# Altium project 温控板.PRJPCB
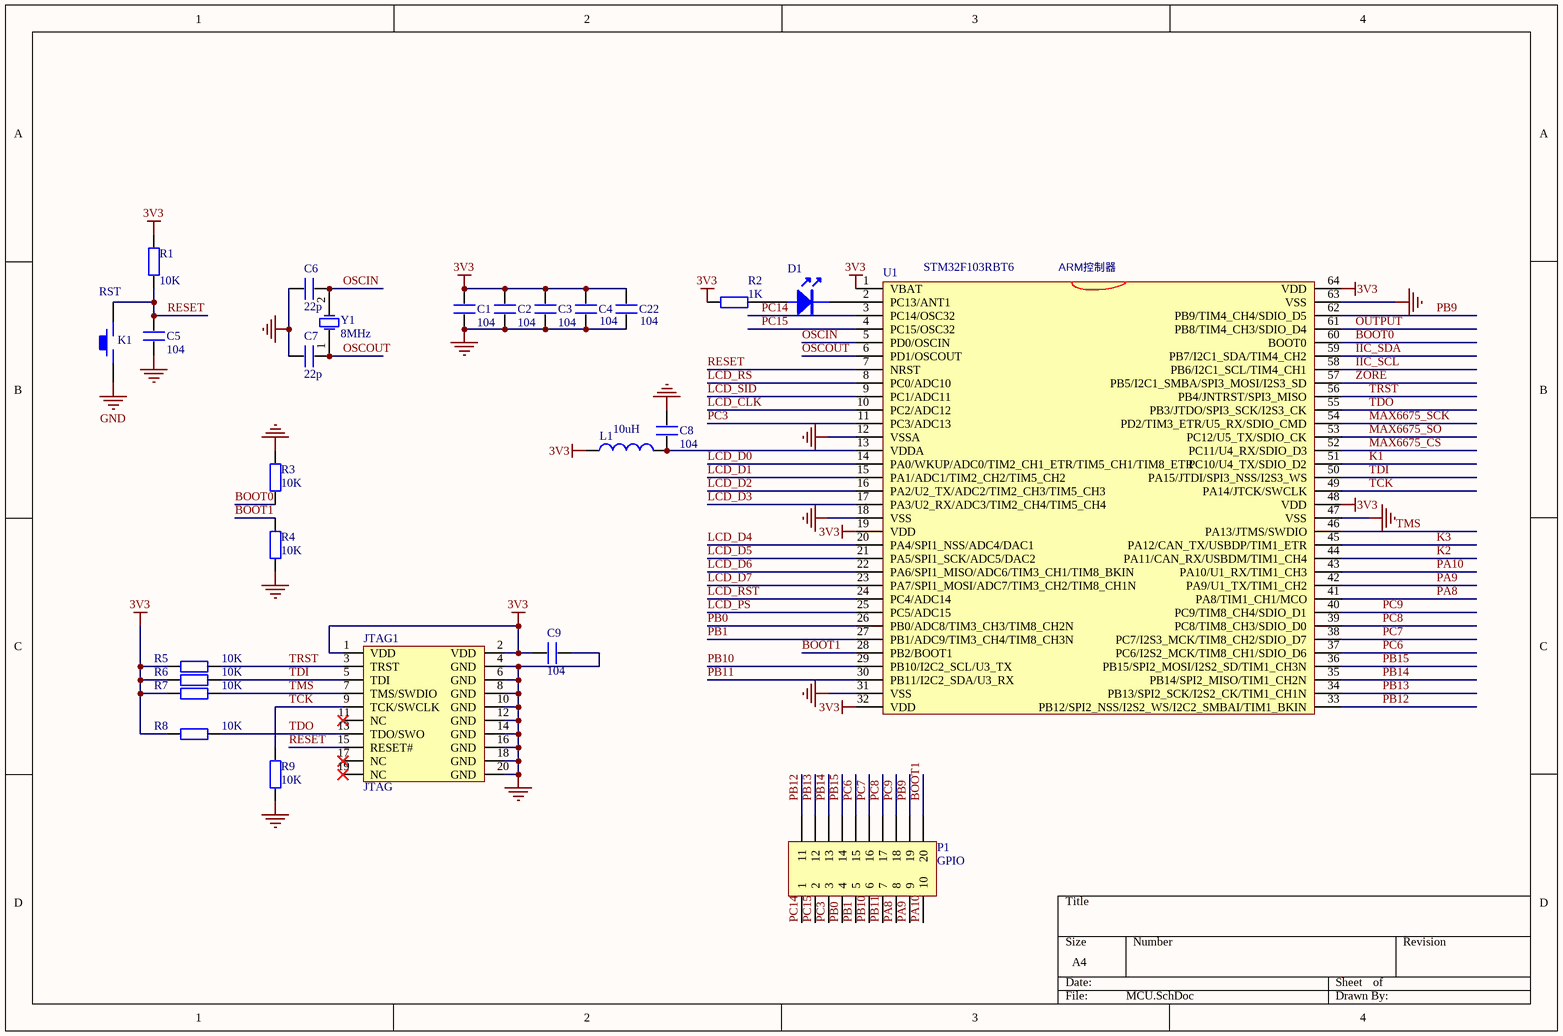
[diagram p0: MCU.SchDoc]
4 sheets, 94 parts. Net scope: global (net labels, ports and power ports of the same name join across sheets).
Board file: 温控PCB_0617F.PcbDoc
Sheets:
  MCU.SchDoc
  MCU电源.SchDoc
  MAX6675.SchDoc
  输出.SchDoc

## Sheet MCU.SchDoc
size A4

### Parts
C1  104  [1206]
C2  104  [1206]
C3  104  [1206]
C4  104  [1206]
C5  104  [1206]
C6  22p  [1206]
C7  22p  [1206]
C8  104  [1206]
C9  104  [1206]
C22  104  [1206]
D1  (no value)  [LED]
JTAG1  JTAG  [JTAG_20]
K1  RST  [KEY_M]
L1  10uH  [1206]
P1  GPIO  [HDR2X10_CEN]
R1  value 10K  [1206]
R2  1K  [1206]
R3  10K  [1206]
R4  10K  [1206]
R5  10K  [1206]
R6  10K  [1206]
R7  10K  [1206]
R8  10K  [1206]
R9  10K  [1206]
U1  STM32F103RBT6  [LQFP64]
Y1  8MHz  [XTAL_US]

### Nets
3V3: C1.1 C2.1 C3.1 C4.1 C9.1 C22.1 JTAG1.1(VDD) JTAG1.2(VDD) L1.1 R1.1 R2.1 R5.1 R6.2 R7.2 R8.2 U1.1(VBAT) U1.19(VDD) U1.32(VDD) U1.48(VDD) U1.64(VDD)
GND: C1.2 C2.2 C3.2 C4.2 C5.2 C6.2 C7.1 C8.1 C9.2 C22.2 JTAG1.4(GND) JTAG1.6(GND) JTAG1.8(GND) JTAG1.10(GND) JTAG1.12(GND) JTAG1.14(GND) JTAG1.16(GND) JTAG1.18(GND) JTAG1.20(GND) K1.1 R3.2 R4.1 R9.1 U1.12(VSSA) U1.18(VSS) U1.31(VSS) U1.47(VSS) U1.63(VSS)
BOOT0: R3.1 U1.60(BOOT0)
BOOT1: P1.20 R4.2 U1.28(PB2/BOOT1)
IIC_SCL: U1.58(PB6/I2C1_SCL/TIM4_CH1)
IIC_SDA: U1.59(PB7/I2C1_SDA/TIM4_CH2)
K1: U1.51(PC10/U4_TX/SDIO_D2)
K2: U1.44(PA11/CAN_RX/USBDM/TIM1_CH4)
K3: U1.45(PA12/CAN_TX/USBDP/TIM1_ETR)
LCD_CLK: U1.10(PC2/ADC12)
LCD_D0: U1.14(PA0/WKUP/ADC0/TIM2_CH1_ETR/TIM5_CH1/TIM8_ETR)
LCD_D1: U1.15(PA1/ADC1/TIM2_CH2/TIM5_CH2)
LCD_D2: U1.16(PA2/U2_TX/ADC2/TIM2_CH3/TIM5_CH3)
LCD_D3: U1.17(PA3/U2_RX/ADC3/TIM2_CH4/TIM5_CH4)
LCD_D4: U1.20(PA4/SPI1_NSS/ADC4/DAC1)
LCD_D5: U1.21(PA5/SPI1_SCK/ADC5/DAC2)
LCD_D6: U1.22(PA6/SPI1_MISO/ADC6/TIM3_CH1/TIM8_BKIN)
LCD_D7: U1.23(PA7/SPI1_MOSI/ADC7/TIM3_CH2/TIM8_CH1N)
LCD_PS: U1.25(PC5/ADC15)
LCD_RS: U1.8(PC0/ADC10)
LCD_RST: U1.24(PC4/ADC14)
LCD_SID: U1.9(PC1/ADC11)
MAX6675_CS: U1.52(PC11/U4_RX/SDIO_D3)
MAX6675_SCK: U1.54(PD2/TIM3_ETR/U5_RX/SDIO_CMD)
MAX6675_SO: U1.53(PC12/U5_TX/SDIO_CK)
OSCIN: C6.1 U1.5(PD0/OSCIN) Y1.2(OSC2)
OSCOUT: C7.2 U1.6(PD1/OSCOUT) Y1.1(OSC1)
OUTPUT: U1.61(PB8/TIM4_CH3/SDIO_D4)
PA8: P1.8 U1.41(PA8/TIM1_CH1/MCO)
PA9: P1.9 U1.42(PA9/U1_TX/TIM1_CH2)
PA10: P1.10 U1.43(PA10/U1_RX/TIM1_CH3)
PB0: P1.4 U1.26(PB0/ADC8/TIM3_CH3/TIM8_CH2N)
PB1: P1.5 U1.27(PB1/ADC9/TIM3_CH4/TIM8_CH3N)
PB9: P1.19 U1.62(PB9/TIM4_CH4/SDIO_D5)
PB10: P1.6 U1.29(PB10/I2C2_SCL/U3_TX)
PB11: P1.7 U1.30(PB11/I2C2_SDA/U3_RX)
PB12: P1.11 U1.33(PB12/SPI2_NSS/I2S2_WS/I2C2_SMBAI/TIM1_BKIN)
PB13: P1.12 U1.34(PB13/SPI2_SCK/I2S2_CK/TIM1_CH1N)
PB14: P1.13 U1.35(PB14/SPI2_MISO/TIM1_CH2N)
PB15: P1.14 U1.36(PB15/SPI2_MOSI/I2S2_SD/TIM1_CH3N)
PC3: P1.3 U1.11(PC3/ADC13)
PC6: P1.15 U1.37(PC6/I2S2_MCK/TIM8_CH1/SDIO_D6)
PC7: P1.16 U1.38(PC7/I2S3_MCK/TIM8_CH2/SDIO_D7)
PC8: P1.17 U1.39(PC8/TIM8_CH3/SDIO_D0)
PC9: P1.18 U1.40(PC9/TIM8_CH4/SDIO_D1)
PC14: P1.1 U1.3(PC14/OSC32)
PC15: P1.2 U1.4(PC15/OSC32)
RESET: C5.1 JTAG1.15(RESET#) K1.2 R1.2 U1.7(NRST)
TCK: JTAG1.9(TCK/SWCLK) R9.2 U1.49(PA14/JTCK/SWCLK)
TDI: JTAG1.5(TDI) R6.1 U1.50(PA15/JTDI/SPI3_NSS/I2S3_WS)
TDO: JTAG1.13(TDO/SWO) R8.1 U1.55(PB3/JTDO/SPI3_SCK/I2S3_CK)
TMS: JTAG1.7(TMS/SWDIO) R7.1 U1.46(PA13/JTMS/SWDIO)
TRST: JTAG1.3(TRST) R5.2 U1.56(PB4/JNTRST/SPI3_MISO)
ZORE: U1.57(PB5/I2C1_SMBA/SPI3_MOSI/I2S3_SD)
NetC8_2: C8.2 L1.2 U1.13(VDDA)
NetD1_A: D1.A R2.2
NetD1_K: D1.K U1.2(PC13/ANT1)

Not connected (* = marked no-connect by the designer): JTAG1 11(NC)* 17(NC)* 19(NC)*

### Notes on the sheet
- (near U1) ARM控制器

### Library data of the parts
C1-C9 C22 = C
D1 = 发光二极管
K1 = KEY_M
L1 = Inductor: Code_IEC: 1005; Published: 8-Jun-2000; LatestRevisionDate: 29-May-2009; LatestRevisionNote: IPC-7351 Footprint Added.; PackageReference: 0402-A; Publisher: Altium Limited; PackageDescription: Chip Inductor; Code_JEITA: 0402
P1 = Header 10X2A: Header, 10-Pin, Dual row; LatestRevisionDate: 17-Jul-2002; LatestRevisionNote: Re-released for DXP Platform.; Publisher: Altium Limited
R1 R3-R6 R8 R9 = Res2: Resistor; Published: 8-Jun-2000; LatestRevisionDate: 17-Jul-2002; LatestRevisionNote: Re-released for DXP Platform.; PackageReference: AXIAL-0.4; Publisher: Altium Limited; PackageDescription: Axial Device, Thru-Hole; 2 Leads; 0.4 in Pin Spacing
  R3-R6 R8 R9: Value: 10K
R2 = Res2: Resistor; Value: 10K; Published: 8-Jun-2000; LatestRevisionDate: 17-Jul-2002; LatestRevisionNote: Re-released for DXP Platform.; PackageReference: AXIAL-0.4; Publisher: Altium Limited; PackageDescription: Axial Device, Thru-Hole; 2 Leads; 0.4 in Pin Spacing
R7 = Res2: Resistor; Rule: PcbType=ProtelPcb; Published: 8-Jun-2000; LatestRevisionDate: 17-Jul-2002; LatestRevisionNote: Re-released for DXP Platform.; PackageReference: AXIAL-0.4; Publisher: Altium Limited; PackageDescription: Axial Device, Thru-Hole; 2 Leads; 0.4 in Pin Spacing; Value: 10K
U1 = STM32F103RDT6
Y1 = XTAL: Crystal Oscillator; Published: 8-Jun-2000; LatestRevisionDate: 17-Jul-2002; LatestRevisionNote: Re-released for DXP Platform.; Publisher: Altium Limited

## Sheet MCU电源.SchDoc
size A4
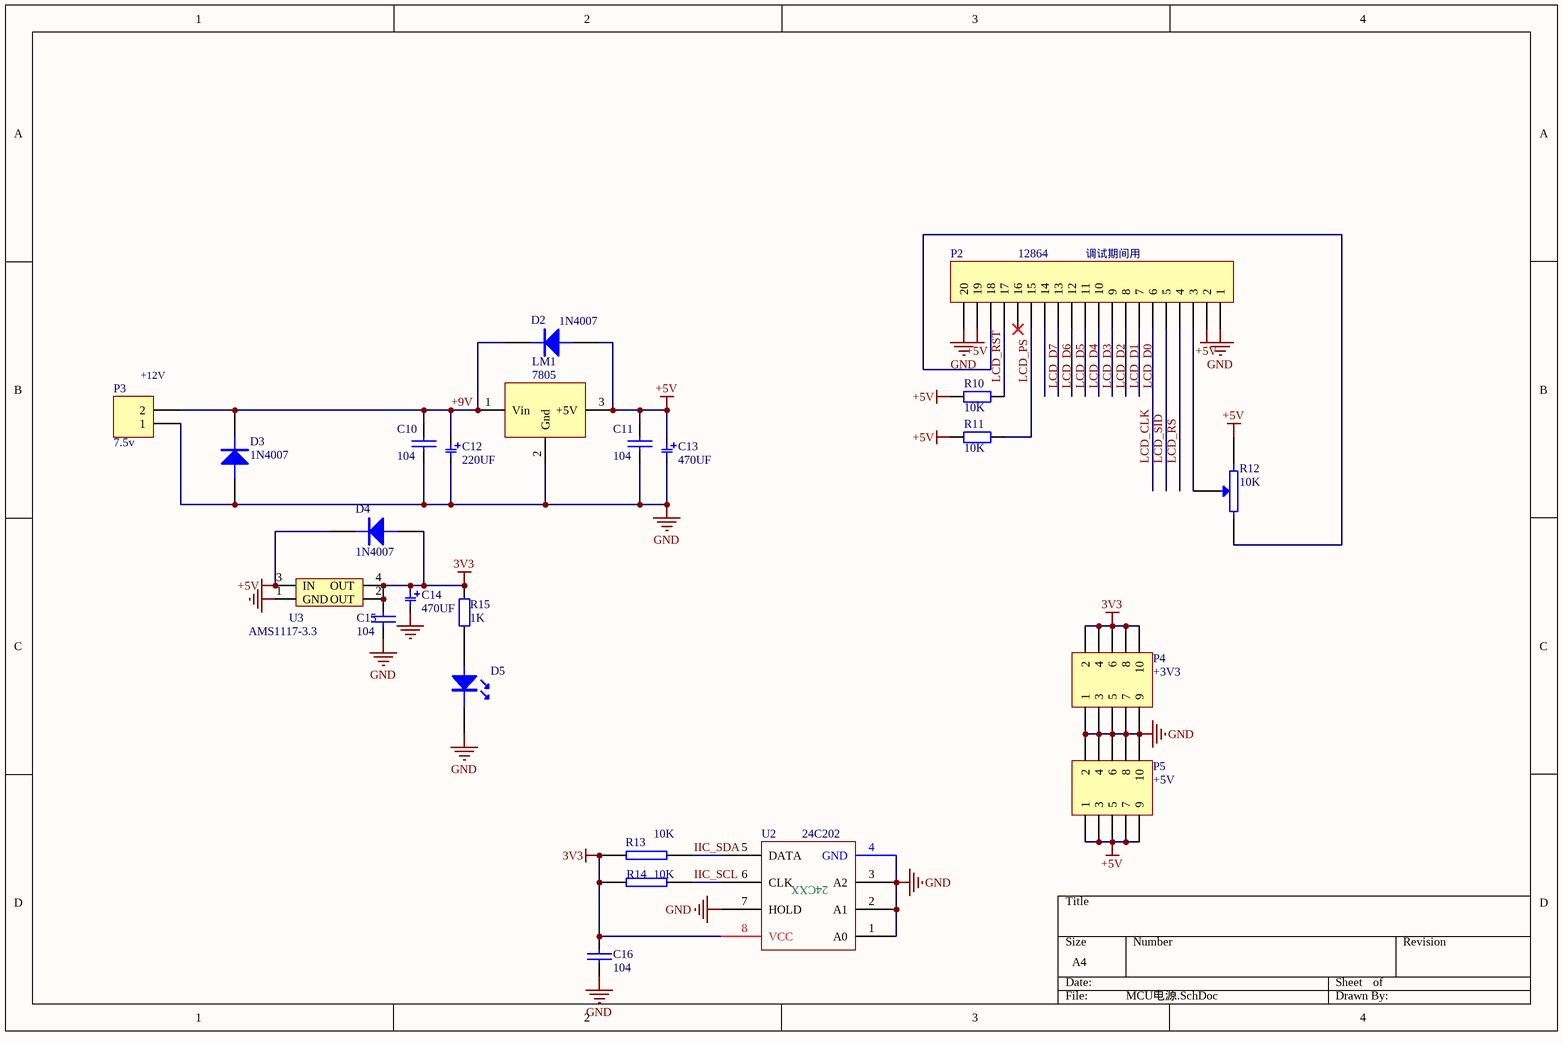
[diagram p1: MCU电源.SchDoc]

### Parts
C10  104  [1206]
C11  104  [1206]
C12  220UF  [C220U]
C13  470UF  [C220U]
C14  470UF  [C220U]
C15  104  [1206]
C16  104  [1206]
D2  1N4007  [7227]
D3  1N4007  [7227]
D4  1N4007  [7227]
D5  (no value)  [LED]
LM1  7805  [TO-220]
P2  12864  [HDR1X20]
P3  7.5v  [OUT_CJ]
P4  +3V3  [HDR2X5]
P5  +5V  [HDR2X5]
R10  10K  [1206]
R11  10K  [1206]
R12  10K  [VR]
R13  10K  [1206]
R14  10K  [1206]
R15  1K  [1206]
U2  24C202  [SO-8]
U3  AMS1117-3.3  [AMS1117]

### Nets
3V3: C14.1 C15.2 C16.2 D4.1(A) P4.2 P4.4 P4.6 P4.8 P4.10 R13.1 R14.1 R15.1 U2.8(VCC) U3.2(OUT) U3.4(OUT)
+5V: C11.2 C13.1 D2.1(A) D4.2(K) LM1.3(+5V) P2.2 P2.19 P5.1 P5.3 P5.5 P5.7 P5.9 R10.1 R11.1 R12.2 U3.3(IN)
GND: C10.1 C11.1 C12.2 C13.2 C14.2 C15.1 C16.1 D3.1(A) D5.K LM1.2(Gnd) P2.1 P2.20 P3.1 P4.1 P4.3 P4.5 P4.7 P4.9 P5.2 P5.4 P5.6 P5.8 P5.10 U2.1(A0) U2.2(A1) U2.3(A2) U2.4(GND) U2.7(HOLD) U3.1(GND)
+9V: C10.2 C12.1 D2.2(K) D3.2(K) LM1.1(Vin) P3.2
IIC_SCL: R14.2 U2.6(CLK)
IIC_SDA: R13.2 U2.5(DATA)
LCD_CLK: P2.6
LCD_D0: P2.7
LCD_D1: P2.8
LCD_D2: P2.9
LCD_D3: P2.10
LCD_D4: P2.11
LCD_D5: P2.12
LCD_D6: P2.13
LCD_D7: P2.14
LCD_PS: P2.15 R11.2
LCD_RS: P2.4
LCD_RST: P2.17 R10.2
LCD_SID: P2.5
NetD5_A: D5.A R15.2
NetP2_3: P2.3 R12.3(W)
NetP2_18: P2.18 R12.1

Not connected (* = marked no-connect by the designer): P2 16*

### Notes on the sheet
- (near P2) 调试期间用
- (near P3) +12V

### Library data of the parts
C10 C11 C15 = 普通电容: Capacitor
C12-C14 = ECAP
C16 = CAP: Capacitor
D2-D4 = DIODE
D5 = 发光二极管
LM1 = LM7805CT
P2 = Header 20: Header, 20-Pin; LatestRevisionDate: 17-Jul-2002; LatestRevisionNote: Re-released for DXP Platform.; Publisher: Altium Limited
P3 = Header 2: Header, 2-Pin; LatestRevisionDate: 17-Jul-2002; LatestRevisionNote: Re-released for DXP Platform.; Publisher: Altium Limited
P4 P5 = Header 5X2: Header, 5-Pin, Dual row; LatestRevisionDate: 17-Jul-2002; LatestRevisionNote: Re-released for DXP Platform.; Publisher: Altium Limited
R10 R11 = Res2: Resistor; Published: 8-Jun-2000; LatestRevisionDate: 17-Jul-2002; LatestRevisionNote: Re-released for DXP Platform.; PackageReference: AXIAL-0.4; Publisher: Altium Limited; PackageDescription: Axial Device, Thru-Hole; 2 Leads; 0.4 in Pin Spacing; Value: 10K
R12 = RESVR: Potentiometer
R13 R14 = RES2
R15 = Res2: Resistor; Value: 10K; Published: 8-Jun-2000; LatestRevisionDate: 17-Jul-2002; LatestRevisionNote: Re-released for DXP Platform.; PackageReference: AXIAL-0.4; Publisher: Altium Limited; PackageDescription: Axial Device, Thru-Hole; 2 Leads; 0.4 in Pin Spacing
U2 = 24CXX
U3 = AMS1117

## Sheet MAX6675.SchDoc
size A4
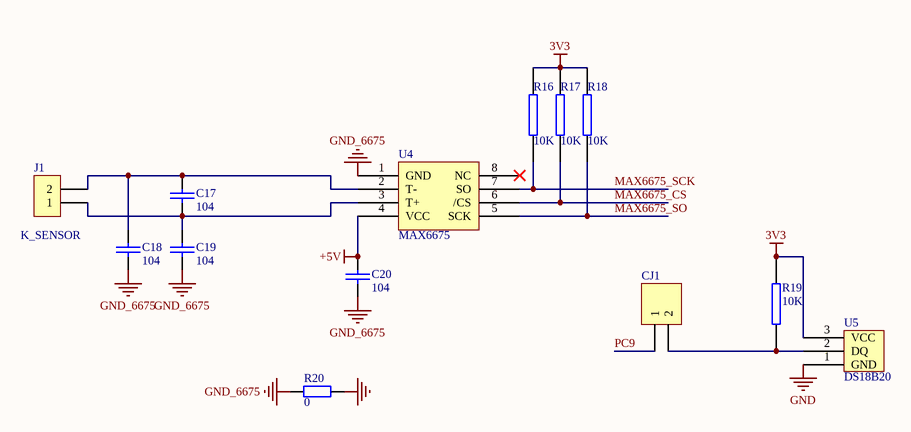
[diagram p2: MAX6675.SchDoc]

### Parts
C17  104  [1206]
C18  104  [1206]
C19  104  [1206]
C20  104  [1206]
CJ1  DS18B20  [HDR1X2]  (value not drawn)
J1  K_SENSOR  [OUT_CJ]
R16  10K  [1206]
R17  10K  [1206]
R18  10K  [1206]
R19  10K  [1206]
R20  0  [1206]
U4  MAX6675  [SO-8]
U5  DS18B20  [DS18B20]

### Nets
3V3: R16.2 R17.2 R18.2 R19.2 U5.3(VCC)
+5V: C20.1 U4.4(VCC)
GND: R20.2 U5.1(GND)
GND_6675: C18.2 C19.2 C20.2 R20.1 U4.1(GND)
MAX6675_CS: R17.1 U4.6(/CS)
MAX6675_SCK: R16.1 U4.7(SO)
MAX6675_SO: R18.1 U4.5(SCK)
PC9: CJ1.1
NetC17_1: C17.1 C18.1 J1.2 U4.2(T-)
NetC17_2: C17.2 C19.1 J1.1 U4.3(T+)
NetCJ1_2: CJ1.2 R19.1 U5.2(DQ)

Not connected (* = marked no-connect by the designer): U4 8(NC)*

### Library data of the parts
C17-C20 = 普通电容: Capacitor
CJ1 = Header 2: Header, 2-Pin; LatestRevisionDate: 17-Jul-2002; LatestRevisionNote: Re-released for DXP Platform.; Publisher: Altium Limited
J1 = CON2: Connector
R16-R19 = RES2
R20 = Res2: Resistor; Value: 10K; Published: 8-Jun-2000; LatestRevisionDate: 17-Jul-2002; LatestRevisionNote: Re-released for DXP Platform.; PackageReference: AXIAL-0.4; Publisher: Altium Limited; PackageDescription: Axial Device, Thru-Hole; 2 Leads; 0.4 in Pin Spacing

## Sheet 输出.SchDoc
size A4
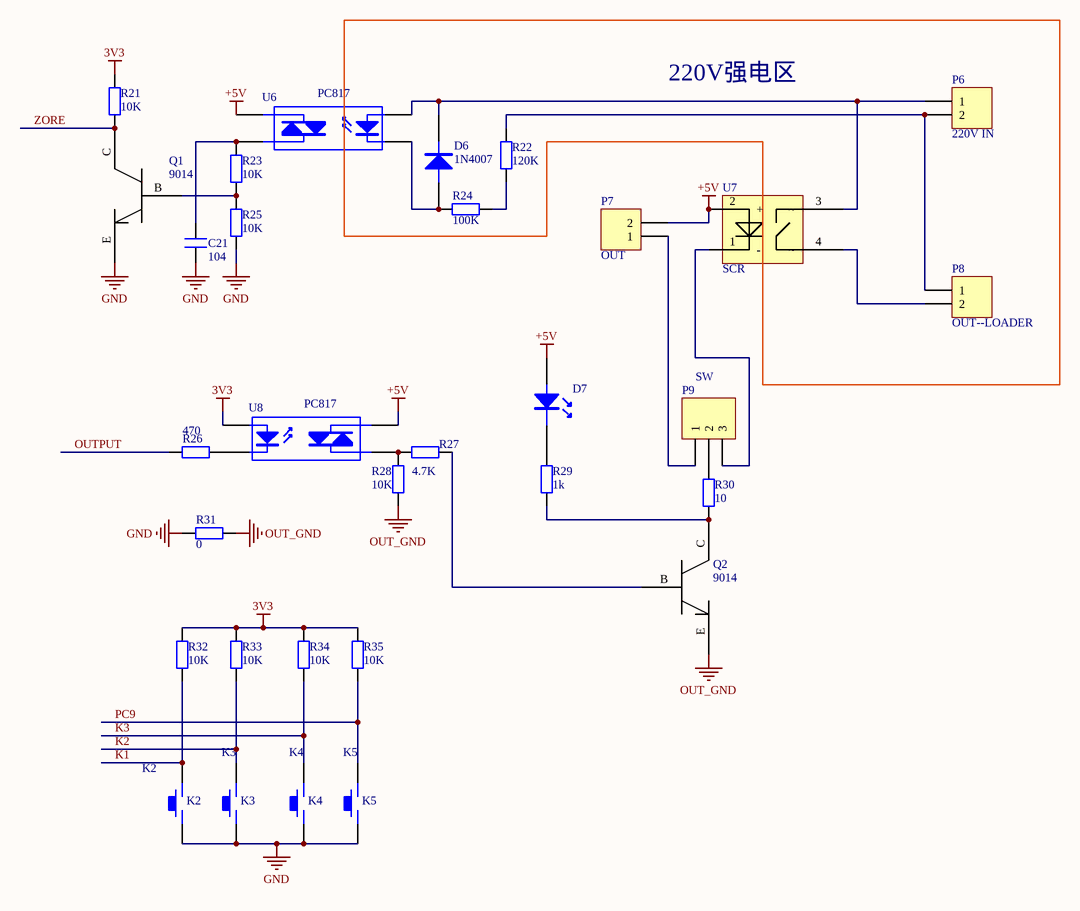
[diagram p3: 输出.SchDoc]

### Parts
C21  104  [1206]
D6  1N4007
D7  (no value)  [LED]
K2  K2  [KEY_M]
K3  K3  [KEY_M]
K4  K4  [KEY_M]
K5  K5  [KEY_M]
P6  220V IN  [OUT_CJ]
P7  OUT  [HDR1X2]
P8  OUT--LOADER  [OUT_CJ]
P9  SW  [HDR1X3]
Q1  9014  [9014]
Q2  9014  [9014]
R21  10K  [1206]
R22  120K  [1206]
R23  10K  [1206]
R24  100K  [1206]
R25  10K  [1206]
R26  470  [1206]
R27  4.7K  [1206]
R28  10K  [1206]
R29  1k  [1206]
R30  10  [1206]
R31  0  [1206]
R32  10K  [1206]
R33  10K  [1206]
R34  10K  [1206]
R35  10K  [1206]
U6  PC817  [pc817]
U7  SCR  [SCR]
U8  PC817  [pc817]

### Blocks framed on the sheet
220V强电区: D6 P6 P8 R22 R24 U7

### Nets
3V3: R21.2 R32.2 R33.2 R34.2 R35.2 U8.1(A)
+5V: D7.A P7.2 U6.3(A/K) U7.2(+) U8.3(A/K)
GND: C21.2 K2.1 K3.1 K4.1 K5.1 Q1.E R25.1 R31.2
OUT_GND: Q2.E R28.1 R31.1
K1: K2.2 R32.1
K2: K3.2 R33.1
K3: K4.2 R34.1
OUTPUT: R26.2
PC9: K5.2 R35.1
ZORE: Q1.C R21.1
NetC21_1: C21.1 R23.2 U6.4(A/K)
NetD6_1: D6.1(A) R24.1 U6.2(K)
NetD6_2: D6.2(K) P6.1 U6.1(A) U7.3
NetD7_K: D7.K R29.2
NetP6_2: P6.2 P8.1 R22.1
NetP7_1: P7.1 P9.1
NetP8_2: P8.2 U7.4
NetP9_2: P9.2 R30.2
NetP9_3: P9.3 U7.1(-)
NetQ1_B: Q1.B R23.1 R25.2
NetQ2_B: Q2.B R27.1
NetQ2_C: Q2.C R29.1 R30.1
NetR22_2: R22.2 R24.2
NetR26_1: R26.1 U8.2(K)
NetR27_2: R27.2 R28.2 U8.4(A/K)

### Library data of the parts
C21 = C
D6 = DIODE
D7 = 发光二极管
K2-K5 = KEY_M
P6-P8 = Header 2: Header, 2-Pin; LatestRevisionDate: 17-Jul-2002; LatestRevisionNote: Re-released for DXP Platform.; Publisher: Altium Limited
P9 = Header 3: Header, 3-Pin; LatestRevisionDate: 17-Jul-2002; LatestRevisionNote: Re-released for DXP Platform.; Publisher: Altium Limited
R21 R23 R25 R28 R32-R35 = Res2: Resistor; Published: 8-Jun-2000; LatestRevisionDate: 17-Jul-2002; LatestRevisionNote: Re-released for DXP Platform.; PackageReference: AXIAL-0.4; Publisher: Altium Limited; PackageDescription: Axial Device, Thru-Hole; 2 Leads; 0.4 in Pin Spacing; Value: 10K
R22 R24 R26 R27 R29-R31 = Res2: Resistor; Value: 10K; Published: 8-Jun-2000; LatestRevisionDate: 17-Jul-2002; LatestRevisionNote: Re-released for DXP Platform.; PackageReference: AXIAL-0.4; Publisher: Altium Limited; PackageDescription: Axial Device, Thru-Hole; 2 Leads; 0.4 in Pin Spacing
U6 U8 = OPTOTRIAC

## Nets that join several sheets
3V3: MCU (20 pins), MCU电源 (15 pins), MAX6675 (5 pins), 输出 (6 pins)
+5V: MCU电源 (16 pins), MAX6675 (C20.1 U4.4), 输出 (5 pins)
GND: MCU (28 pins), MCU电源 (29 pins), MAX6675 (R20.2 U5.1), 输出 (8 pins)
IIC_SCL: MCU (U1.58), MCU电源 (R14.2 U2.6)
IIC_SDA: MCU (U1.59), MCU电源 (R13.2 U2.5)
K1: MCU (U1.51), 输出 (K2.2 R32.1)
K2: MCU (U1.44), 输出 (K3.2 R33.1)
K3: MCU (U1.45), 输出 (K4.2 R34.1)
LCD_CLK: MCU (U1.10), MCU电源 (P2.6)
LCD_D0: MCU (U1.14), MCU电源 (P2.7)
LCD_D1: MCU (U1.15), MCU电源 (P2.8)
LCD_D2: MCU (U1.16), MCU电源 (P2.9)
LCD_D3: MCU (U1.17), MCU电源 (P2.10)
LCD_D4: MCU (U1.20), MCU电源 (P2.11)
LCD_D5: MCU (U1.21), MCU电源 (P2.12)
LCD_D6: MCU (U1.22), MCU电源 (P2.13)
LCD_D7: MCU (U1.23), MCU电源 (P2.14)
LCD_PS: MCU (U1.25), MCU电源 (P2.15 R11.2)
LCD_RS: MCU (U1.8), MCU电源 (P2.4)
LCD_RST: MCU (U1.24), MCU电源 (P2.17 R10.2)
LCD_SID: MCU (U1.9), MCU电源 (P2.5)
MAX6675_CS: MCU (U1.52), MAX6675 (R17.1 U4.6)
MAX6675_SCK: MCU (U1.54), MAX6675 (R16.1 U4.7)
MAX6675_SO: MCU (U1.53), MAX6675 (R18.1 U4.5)
OUTPUT: MCU (U1.61), 输出 (R26.2)
PC9: MCU (P1.18 U1.40), MAX6675 (CJ1.1), 输出 (K5.2 R35.1)
ZORE: MCU (U1.57), 输出 (Q1.C R21.1)